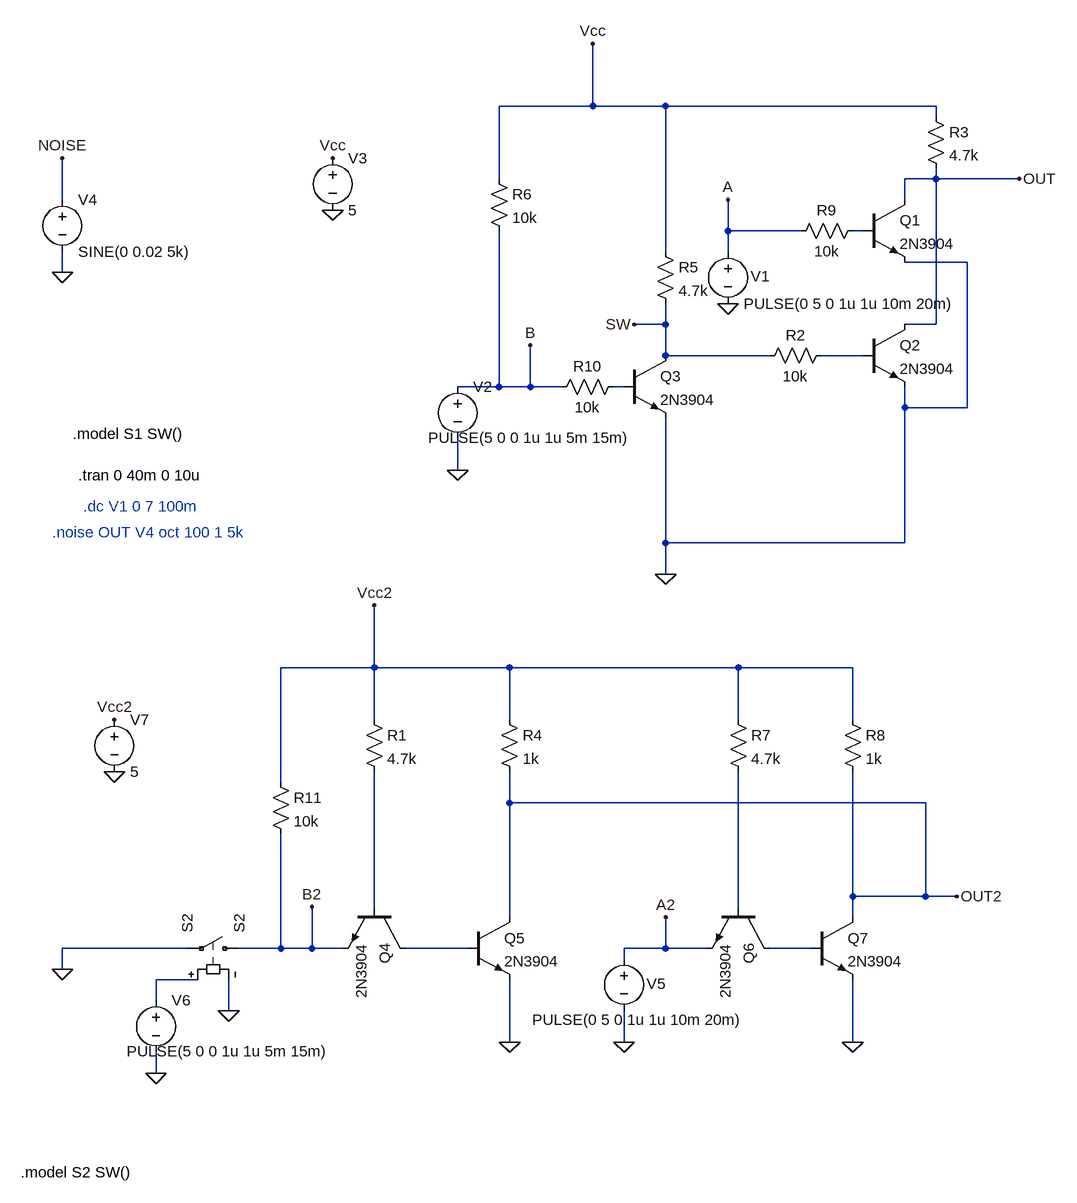
[diagram p0: schematic transistor_nor.asc]
transistor_nor.asc, the LTspice schematic file:
Version 4.1
SHEET 1 2148 1480
WIRE -208 -176 -208 -272
WIRE -208 -176 -352 -176
WIRE -96 -176 -208 -176
WIRE 320 -176 -96 -176
WIRE 320 -160 320 -176
WIRE -352 -64 -352 -176
WIRE 320 -64 320 -80
WIRE 320 -64 272 -64
WIRE 448 -64 320 -64
WIRE -1024 -32 -1024 -96
WIRE 272 -32 272 -64
WIRE 0 16 0 -32
WIRE 112 16 0 16
WIRE 208 16 192 16
WIRE -96 48 -96 -176
WIRE 0 48 0 16
WIRE 368 64 272 64
WIRE -1024 80 -1024 48
WIRE -96 160 -96 128
WIRE -96 160 -144 160
WIRE 320 160 320 -64
WIRE 320 160 272 160
WIRE -96 208 -96 160
WIRE 64 208 -96 208
WIRE 208 208 144 208
WIRE -352 256 -352 16
WIRE -352 256 -416 256
WIRE -304 256 -304 192
WIRE -304 256 -352 256
WIRE -256 256 -304 256
WIRE -160 256 -176 256
WIRE 272 288 272 256
WIRE 368 288 368 64
WIRE 368 288 272 288
WIRE -416 384 -416 336
WIRE -96 496 -96 304
WIRE 272 496 272 288
WIRE 272 496 -96 496
WIRE -96 544 -96 496
WIRE -544 688 -544 592
WIRE -544 688 -688 688
WIRE -336 688 -544 688
WIRE 16 688 -336 688
WIRE 192 688 16 688
WIRE -544 768 -544 688
WIRE -336 768 -336 688
WIRE 16 768 16 688
WIRE 192 768 192 688
WIRE -688 864 -688 688
WIRE -336 896 -336 848
WIRE 304 896 -336 896
WIRE 192 1040 192 848
WIRE 304 1040 304 896
WIRE 304 1040 192 1040
WIRE 352 1040 304 1040
WIRE -544 1056 -544 848
WIRE 16 1056 16 848
WIRE -336 1072 -336 896
WIRE 192 1072 192 1040
WIRE -832 1120 -1024 1120
WIRE -688 1120 -688 944
WIRE -688 1120 -752 1120
WIRE -640 1120 -640 1056
WIRE -640 1120 -688 1120
WIRE -592 1120 -640 1120
WIRE -400 1120 -496 1120
WIRE -96 1120 -96 1072
WIRE -96 1120 -160 1120
WIRE -32 1120 -96 1120
WIRE 128 1120 64 1120
WIRE -160 1136 -160 1120
WIRE -1024 1152 -1024 1120
WIRE -816 1168 -880 1168
WIRE -880 1200 -880 1168
WIRE -768 1216 -768 1168
WIRE -336 1264 -336 1168
WIRE -160 1264 -160 1216
WIRE 192 1264 192 1168
WIRE -880 1312 -880 1280
FLAG 0 128 0
FLAG -416 384 0
FLAG -608 -16 0
FLAG -608 -96 Vcc
FLAG -208 -272 Vcc
FLAG 448 -64 OUT
FLAG 0 -32 A
FLAG -96 544 0
FLAG -304 192 B
FLAG -1024 80 0
FLAG -1024 -96 NOISE
FLAG -144 160 SW
FLAG -880 1312 0
FLAG -944 848 0
FLAG -944 768 Vcc2
FLAG -544 592 Vcc2
FLAG -768 1216 0
FLAG -1024 1152 0
FLAG -640 1056 B2
FLAG -336 1264 0
FLAG -160 1264 0
FLAG 192 1264 0
FLAG 352 1040 OUT2
FLAG -96 1072 A2
SYMBOL voltage 0 32 R0
WINDOW 123 0 0 Left 0
WINDOW 39 0 0 Left 0
WINDOW 0 35 54 Left 2
SYMATTR InstName V1
SYMATTR Value PULSE(0 5 0 1u 1u 10m 20m)
SYMBOL voltage -416 240 R0
WINDOW 123 0 0 Left 0
WINDOW 39 0 0 Left 0
WINDOW 3 -45 94 Left 2
SYMATTR Value PULSE(5 0 0 1u 1u 5m 15m)
SYMATTR InstName V2
SYMBOL npn 208 -32 R0
SYMATTR InstName Q1
SYMATTR Value 2N3904
SYMBOL npn 208 160 R0
SYMATTR InstName Q2
SYMATTR Value 2N3904
SYMBOL res 160 192 R90
WINDOW 0 0 56 VBottom 2
WINDOW 3 32 56 VTop 2
SYMATTR InstName R2
SYMATTR Value 10k
SYMBOL voltage -608 -112 R0
WINDOW 123 0 0 Left 0
WINDOW 39 0 0 Left 0
SYMATTR InstName V3
SYMATTR Value 5
SYMBOL res 304 -176 R0
SYMATTR InstName R3
SYMATTR Value 4.7k
SYMBOL npn -160 208 R0
SYMATTR InstName Q3
SYMATTR Value 2N3904
SYMBOL res -112 32 R0
SYMATTR InstName R5
SYMATTR Value 4.7k
SYMBOL res -368 -80 R0
SYMATTR InstName R6
SYMATTR Value 10k
SYMBOL res 208 0 R90
WINDOW 0 0 56 VBottom 2
WINDOW 3 32 56 VTop 2
SYMATTR InstName R9
SYMATTR Value 10k
SYMBOL res -160 240 R90
WINDOW 0 0 56 VBottom 2
WINDOW 3 32 56 VTop 2
SYMATTR InstName R10
SYMATTR Value 10k
SYMBOL voltage -1024 -48 R0
WINDOW 123 0 0 Left 0
WINDOW 39 0 0 Left 0
SYMATTR InstName V4
SYMATTR Value SINE(0 0.02 5k)
SYMBOL voltage -880 1184 R0
WINDOW 123 0 0 Left 0
WINDOW 39 0 0 Left 0
WINDOW 3 -45 94 Left 2
SYMATTR Value PULSE(5 0 0 1u 1u 5m 15m)
SYMATTR InstName V6
SYMBOL voltage -944 752 R0
WINDOW 123 0 0 Left 0
WINDOW 39 0 0 Left 0
SYMATTR InstName V7
SYMATTR Value 5
SYMBOL sw -736 1120 M270
SYMATTR InstName S2
SYMATTR Value S2
SYMBOL npn -496 1056 R90
SYMATTR InstName Q4
SYMATTR Value 2N3904
SYMBOL npn -400 1072 R0
SYMATTR InstName Q5
SYMATTR Value 2N3904
SYMBOL res -560 752 R0
SYMATTR InstName R1
SYMATTR Value 4.7k
SYMBOL res -352 752 R0
SYMATTR InstName R4
SYMATTR Value 1k
SYMBOL voltage -160 1120 R0
WINDOW 123 0 0 Left 0
WINDOW 39 0 0 Left 0
WINDOW 0 35 54 Left 2
WINDOW 3 -141 110 Left 2
SYMATTR InstName V5
SYMATTR Value PULSE(0 5 0 1u 1u 10m 20m)
SYMBOL npn 64 1056 R90
SYMATTR InstName Q6
SYMATTR Value 2N3904
SYMBOL npn 128 1072 R0
SYMATTR InstName Q7
SYMATTR Value 2N3904
SYMBOL res 0 752 R0
SYMATTR InstName R7
SYMATTR Value 4.7k
SYMBOL res 176 752 R0
SYMATTR InstName R8
SYMATTR Value 1k
SYMBOL res -704 848 R0
SYMATTR InstName R11
SYMATTR Value 10k
TEXT -1000 392 Left 2 !.tran 0 40m 0 10u
TEXT -1008 328 Left 2 !.model S1 SW()
TEXT -992 440 Left 2 ;.dc V1 0 7 100m
TEXT -1040 480 Left 2 ;.noise OUT V4 oct 100 1 5k
TEXT -1088 1464 Left 2 !.model S2 SW()

The netlist it stands for:
* transistor_nor.asc
V1 A 0 PULSE(0 5 0 1u 1u 10m 20m)
V2 B 0 PULSE(5 0 0 1u 1u 5m 15m)
Q1 OUT N001 0 0 2N3904
Q2 OUT N002 0 0 2N3904
R2 N002 SW 10k
V3 Vcc 0 5
R3 Vcc OUT 4.7k
Q3 SW N003 0 0 2N3904
R5 Vcc SW 4.7k
R6 Vcc B 10k
R9 N001 A 10k
R10 N003 B 10k
V4 NOISE 0 SINE(0 0.02 5k)
V6 N008 0 PULSE(5 0 0 1u 1u 5m 15m)
V7 Vcc2 0 5
S2 B2 0 N008 0 S2
Q4 N006 N004 B2 0 2N3904
Q5 OUT2 N006 0 0 2N3904
R1 Vcc2 N004 4.7k
R4 Vcc2 OUT2 1k
V5 A2 0 PULSE(0 5 0 1u 1u 10m 20m)
Q6 N007 N005 A2 0 2N3904
Q7 OUT2 N007 0 0 2N3904
R7 Vcc2 N005 4.7k
R8 Vcc2 OUT2 1k
R11 Vcc2 B2 10k
.model NPN NPN
.model PNP PNP
.lib standard.bjt
.tran 0 40m 0 10u
.model S1 SW()
* .dc V1 0 7 100m
* .noise OUT V4 oct 100 1 5k
.model S2 SW()
.backanno
.end